# EasyEDA Pro project ProPrj_Inverted_MAML_6x6_2026-09-04(1).epro, schematic ETH_PHY
Create Date: 2025-12-23; Page Name: P1; Project Name: FPGA_motors_V3_0_4; Schematic Name: ETH_PHY; Update Date: 2025-12-23; Company: EasyEDA.com; Page Size: A4; Version: V1.0
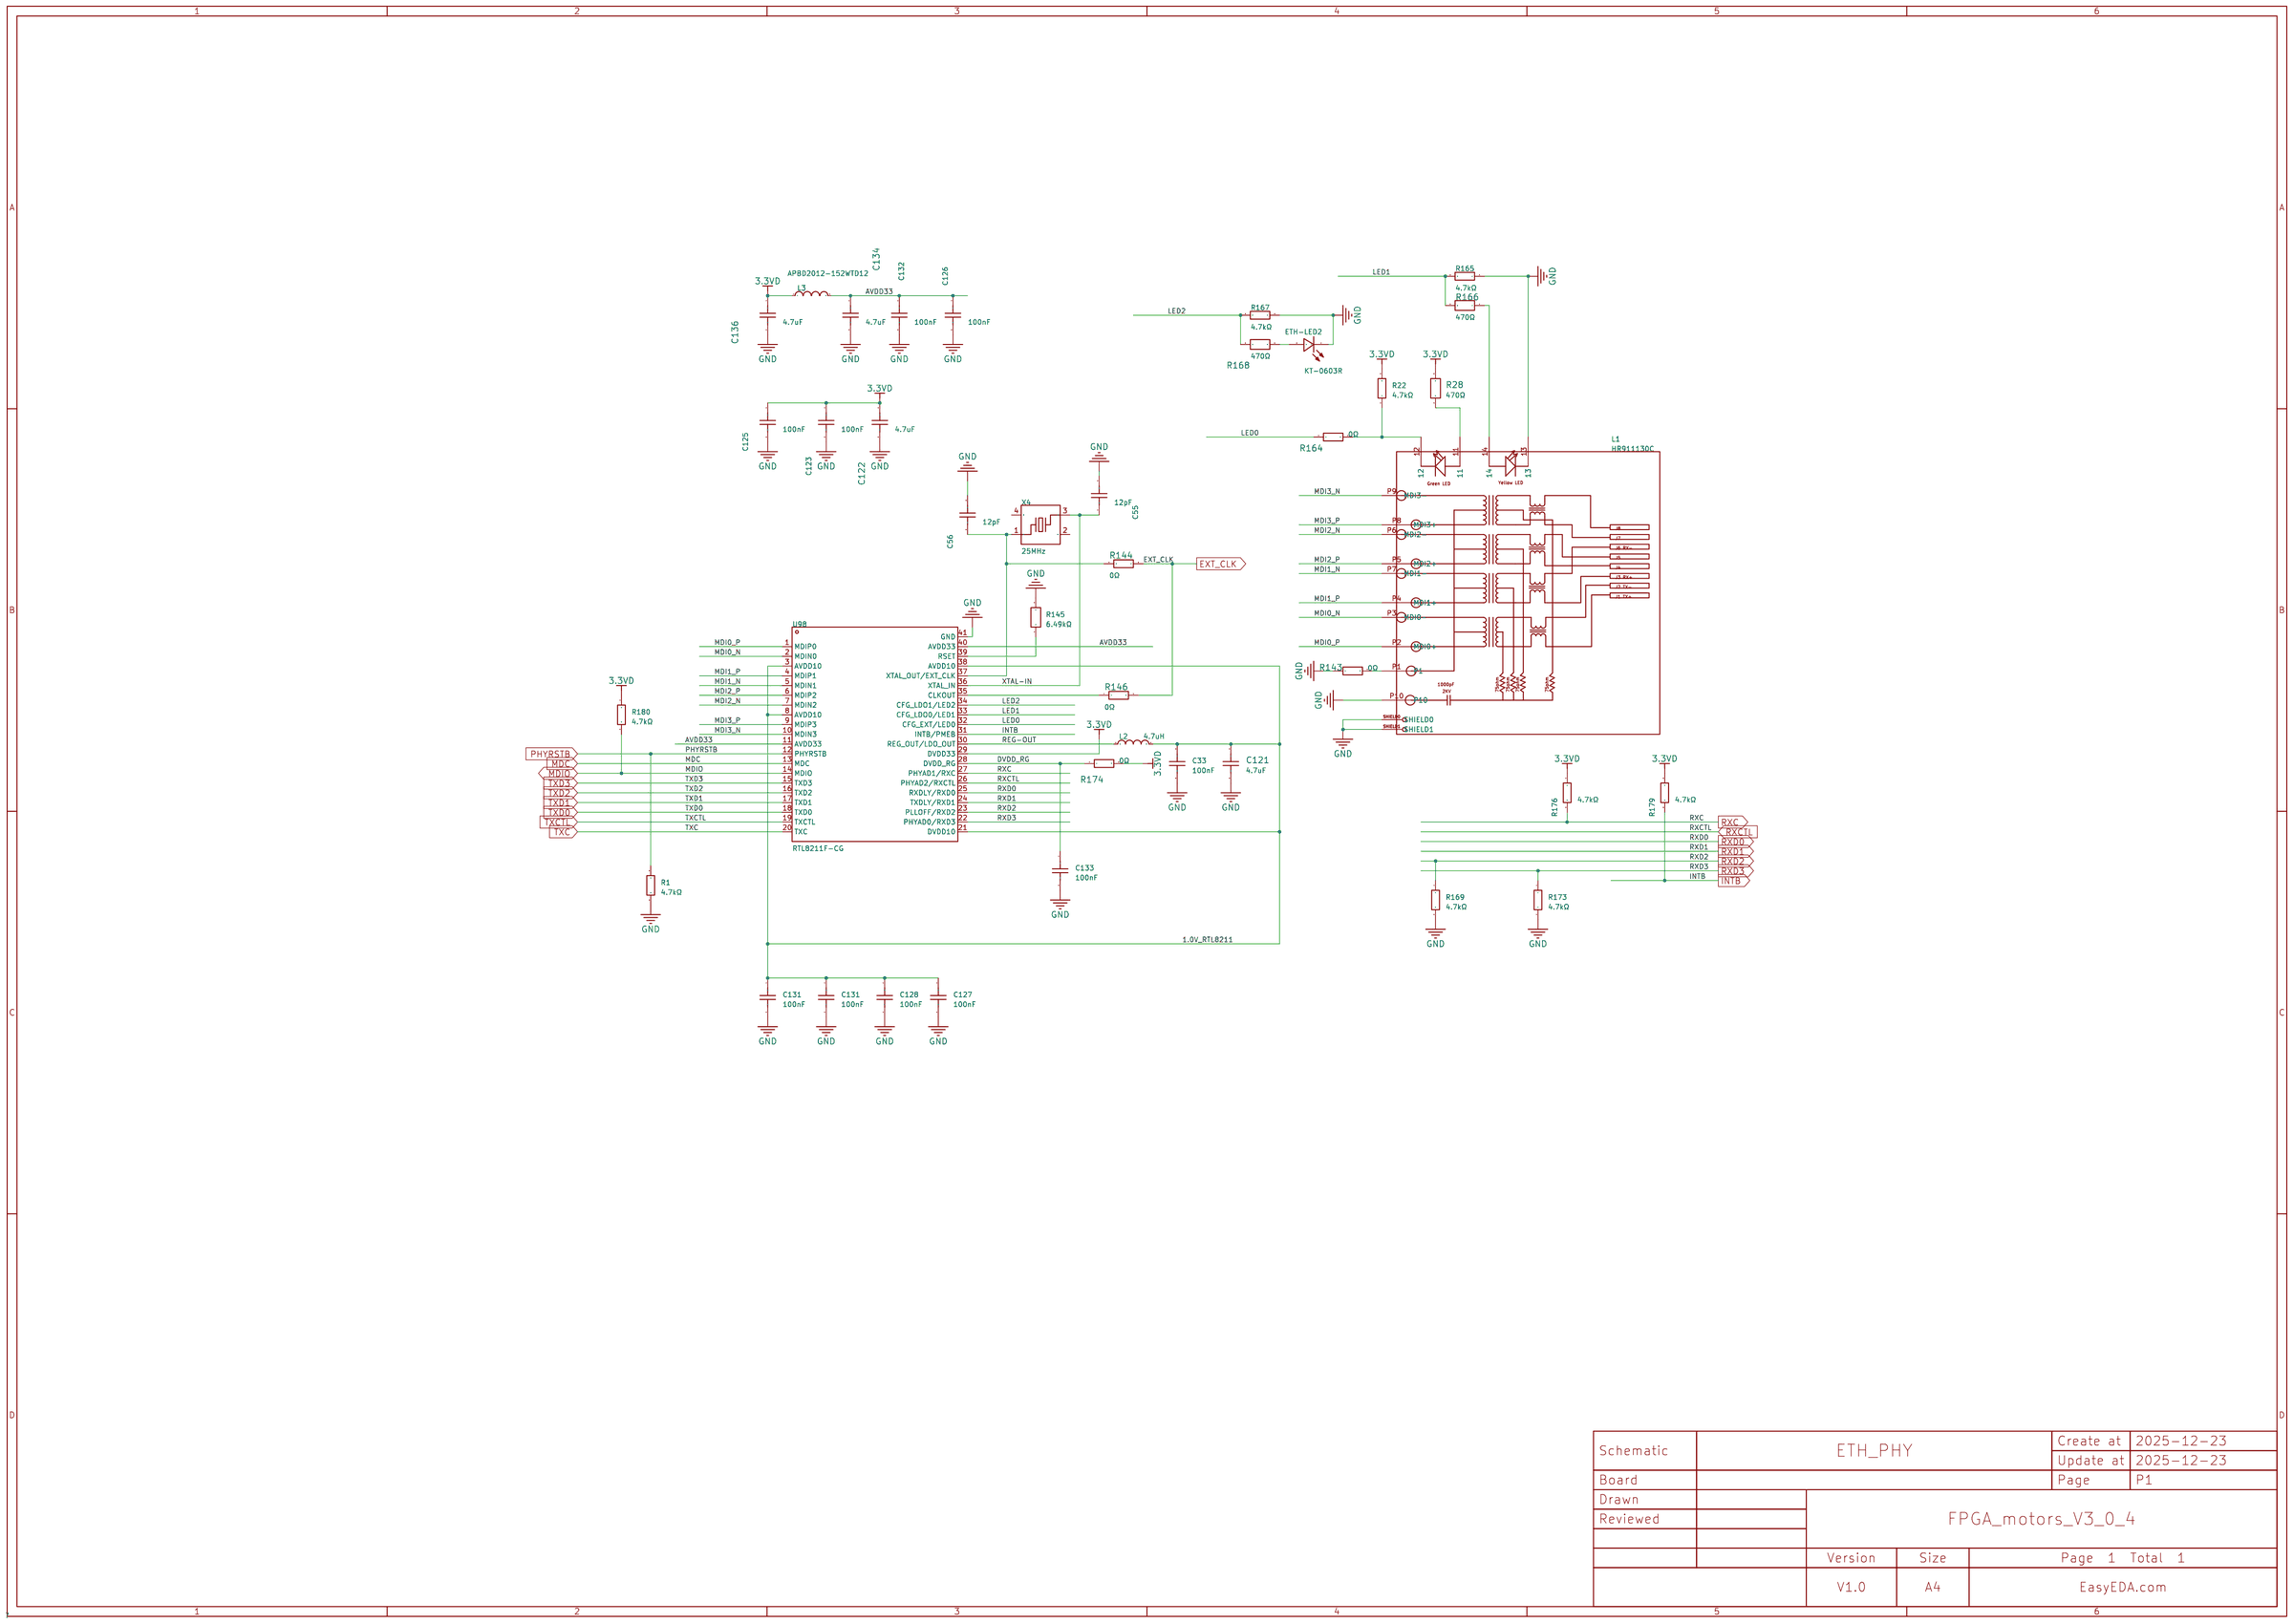
[diagram p3: schematic sheet]

## Parts
C33  100nF  [C0402]
C55  12pF  [C0402]
C56  12pF  [C0402]
C121  4.7uF  [C0402]
C122  4.7uF  [C0402]
C123  100nF  [C0402]
C125  100nF  [C0402]
C126  100nF  [C0402]
C127  100nF  [C0402]
C128  100nF  [C0402]
C131  100nF  [C0402]
C131#2  100nF  [C0402]
C132  100nF  [C0402]
C133  100nF  [C0402]
C134  4.7uF  [C0402]
C136  4.7uF  [C0402]
ETH-LED2  KT-0603R  [LED0603-RD]
L1  HR911130C  [RJ45-TH_HR911130C]
L2  4.7uH  [IND-SMD_L7.8-W7.0_SUMIDA_CD73]
L3  APBD2012-152WTD12  [L0805]
R1  4.7kΩ  [R0402]
R22  4.7kΩ  [R0402]
R28  470Ω  [R0402]
R143  0Ω  [R0402]
R144  0Ω  [R0402]  (no BOM)
R145  6.49kΩ  [R0402]
R146  0Ω  [R0402]  (no BOM)
R164  0Ω  [R0402]
R165  4.7kΩ  [R0402]
R166  470Ω  [R0402]
R167  4.7kΩ  [R0402]
R168  470Ω  [R0402]
R169  4.7kΩ  [R0402]
R173  4.7kΩ  [R0402]  (no BOM)
R174  0Ω  [R0402]
R176  4.7kΩ  [R0402]  (no BOM)
R179  4.7kΩ  [R0402]
R180  4.7kΩ  [R0402]
U98  RTL8211F-CG  [WQFN-40_L5.0-W5.0-P0.4-BL-EP]
X4  25MHz  [CRYSTAL-SMD_4P-L5.0-W3.2-BL]

## Library data of the parts
C33 C123 C125-C128 C131 C131#2 C132 C133 = CL05B104KB54PNC: Capacitance: Tolerance:±10% Tolerance:±10% Voltage Rated: Temperature Coefficient:; LCSC Part Name: 100nF ±10% 50V; Supplier Part: C307331; Manufacturer: SAMSUNG(三星); Supplier Footprint: 0402; JLCPCB Part Class: Basic Part; Datasheet: https://atta.szlcsc.com/upload/public/pdf/source/20160218/1457707763339.pdf; Supplier: LCSC; Tolerance: ±10%; Check: true
C55 C56 = V120J0402HQC500NBT: Capacitance:12pF Voltage Rating:50V Temperature Coefficient:C0G; LCSC Part Name: ±5pF 12pF 50V; Supplier Part: C5251212; Manufacturer: VIIYONG(微容); Supplier Footprint: 0402; JLCPCB Part Class: Extended Part; Datasheet: https://atta.szlcsc.com/upload/public/pdf/source/20210621/C2841456_D184B2C3CE76695828CADF567D00C122.pdf; Supplier: LCSC; Voltage Rating: 50V; Temperature Coefficient: C0G; Check: true
C121 C122 C134 C136 = LMK105BBJ475MVLF: Capacitance: Tolerance:±20% Tolerance:±20% Voltage Rated: Temperature Coefficient:; LCSC Part Name: 4.7uF ±20% 10V; Supplier Part: C23733; Manufacturer: TAIYO YUDEN(太诱); Supplier Footprint: 0402; JLCPCB Part Class: Extended Part; Datasheet: https://atta.szlcsc.com/upload/public/pdf/source/20210525/C2802164_C0429B055888A674C3F00BA74B841C5B.pdf; Supplier: LCSC; Tolerance: ±20%; Check: true
ETH-LED2 = KT-0603R: Emitted Color:Red Power Dissipation:- Forward Current:- Dominant Wavelength:- Dominant Wavelength:- Peak Wavelength:- Diode Configuration:- Lens Color:- Color Temperature:- Color Temperature:- Viewing Angle:- Mounting Sytle:- Operating Temperature:-40℃~+8; LCSC Part Name: 0603 红灯 高亮; Supplier Part: C2286; Manufacturer: KENTO; Supplier Footprint: 0603; JLCPCB Part Class: Basic Part; Datasheet: https://atta.szlcsc.com/upload/public/pdf/source/20160616/1466072038404.pdf; Supplier: LCSC; Emitted Color: Red; Operating Temperature: -40℃~+85℃
L1 = HR911130C: Connector Type:RJ45 Jack Mounting Type:Right Angle Number of Ports:1 LED:With LED Shielding:Shielded Ratings:- Operating Temperature:- Operating Temperature:-; LCSC Part Name: 弯插 带LED; Supplier Part: C50933; Manufacturer: HANRUN(汉仁); Supplier Footprint: 插件; JLCPCB Part Class: Extended Part; Datasheet: https://item.szlcsc.com/datasheet/HR911130C/51945.html; Supplier: LCSC; Connector Type: RJ45 Jack; Mounting Type: Right Angle; Number of Ports: 1; LED: With LED; Shielding: Shielded
L2 = FCD75-4R7M: Inductance:4.7uH Tolerance:±20% Tolerance:±20% Current - Saturation(Isat):4.2A DC Resistance(DCR):30mΩ Type:-; LCSC Part Name: SMD,7.8*7.0*5.0mm(0705)CD电感; Supplier Part: C41382395; Manufacturer: cjiang(长江微电); Supplier Footprint: SMD,7.8x7mm; Datasheet: https://atta.szlcsc.com/upload/public/pdf/source/20240910/39AFF787A42FA6B55710C93C1E169A83.pdf; Supplier: LCSC; Tolerance: ±20%; Current - Saturation(Isat): 4.2A; DC Resistance(DCR): 30mΩ
L3 = APBD2012-152WTD12: Impedance @ Frequency:1.5kΩ@100MHz Tolerance:±25% Tolerance:±25% DC Resistance(DCR):400mΩ Current Rating:550mA Operating Temperature:-55℃~+125℃ Operating Temperature:-55℃~+125℃; Supplier Part: C50325953; Manufacturer: APV(爱普微); Supplier Footprint: 0805; JLCPCB Part Class: Extended Part; Datasheet: https://item.szlcsc.com/datasheet/APBD2012-152WTD12/52921127.html; Supplier: LCSC; Impedance @ Frequency: 1.5kΩ@100MHz; Tolerance: ±25%; DC Resistance(DCR): 400mΩ; Current Rating: 550mA; Operating Temperature: -55℃~+125℃
R1 R22 R165 R167 R169 R173 R176 R179 R180 = 0402WGF4701TCE: Type:Thick Film Resistors Resistance:4.7kΩ Tolerance:±1% Tolerance:±1% Power(Watts): Overload Voltage (Max): Temperature Coefficient:±100ppm/℃ Temperature Coefficient:±100ppm/℃ Operating Temperature Range:-55℃~+155℃ Operating Temperature Range:-55℃~+155℃; LCSC Part Name: 4.7kΩ ±1% 62.5mW 厚膜电阻; Supplier Part: C25900; Manufacturer: UNI-ROYAL(厚声); Supplier Footprint: 0402; JLCPCB Part Class: Basic Part; Datasheet: https://item.szlcsc.com/datasheet/0402WGF4701TCE/26643.html; Supplier: LCSC; Type: Thick Film Resistor; Tolerance: ±1%; Power(Watts): 62.5mW; Voltage-Supply(Max): 50V; Temperature Coefficient: ±100ppm/℃; Operating Temperature: -55℃~+155℃
R28 R166 R168 = 0402WGF4700TCE: Type:Thick Film Resistors Resistance: Tolerance:±1% Tolerance:±1% Power(Watts): Overload Voltage (Max): Temperature Coefficient:±100ppm/℃ Temperature Coefficient:±100ppm/℃ Operating Temperature Range:-55℃~+155℃ Operating Temperature Range:-55℃~+155℃; LCSC Part Name: 470Ω ±1% 62.5mW 厚膜电阻; Supplier Part: C25117; Manufacturer: UNI-ROYAL(厚声); Supplier Footprint: 0402; JLCPCB Part Class: Basic Part; Datasheet: https://atta.szlcsc.com/upload/public/pdf/source/20200306/C422600_1E6D84923E4A46A82E41ADD87F860B5C.pdf; Supplier: LCSC; Type: Thick Film Resistors; Tolerance: ±1%; Temperature Coefficient: ±100ppm/℃; Operating Temperature Range: -55℃~+155℃
R143 R144 R146 R164 R174 = 0402WGF0000TCE: Type:Thick Film Resistor Resistance:0Ω Tolerance:±1% Tolerance:±1% Power(Watts):62.5mW Voltage-Supply(Max):50V Temperature Coefficient:±800ppm/℃ Temperature Coefficient:±800ppm/℃ Operating Temperature:-55℃~+155℃ Operating Temperature:-55℃~+155℃; LCSC Part Name: 0Ω ±1% 62.5mW 厚膜电阻; Supplier Part: C17168; Manufacturer: UNI-ROYAL(厚声); Supplier Footprint: 0402; JLCPCB Part Class: Basic Part; Datasheet: https://item.szlcsc.com/datasheet/0402WGF0000TCE/17853.html; Supplier: LCSC; Type: Thick Film Resistor; Tolerance: ±1%; Power(Watts): 62.5mW; Voltage-Supply(Max): 50V; Temperature Coefficient: ±800ppm/℃; Operating Temperature: -55℃~+155℃
R145 = RT0402BRE076K49L: Type:Thin Film Resistor Resistance: Tolerance:±0.1% Tolerance:±0.1% Power(Watts): Temperature Coefficient:±50ppm/℃ Temperature Coefficient:±50ppm/℃ Operating Temperature Range:-55℃~+155℃ Operating Temperature Range:-55℃~+155℃; LCSC Part Name: 薄膜电阻 6.49kΩ ±0.1% 62.5mW; Supplier Part: C853380; Manufacturer: YAGEO(国巨); Supplier Footprint: 0402; JLCPCB Part Class: Extended Part; Datasheet: https://atta.szlcsc.com/upload/public/pdf/source/20200610/C326738_5639A9F1B6EB6E4AE2197577D3456E7F.pdf; Supplier: LCSC; Type: Thin Film Resistor; Tolerance: ±0.1%; Temperature Coefficient: ±50ppm/℃; Operating Temperature Range: -55℃~+155℃
U98 = RTL8211F-CG: Applications Function:- Number of Channels:- MAC Interface:RGMII Voltage - Supply:1.8V；2.5V；3.3V；1.5V Voltage - Supply:1.8V；2.5V；3.3V；1.5V; LCSC Part Name: 集成10/100/1000M以太网精密收发器; Supplier Part: C187932; Manufacturer: REALTEK(瑞昱); Supplier Footprint: WQFN-40-EP(5x5); JLCPCB Part Class: Extended Part; Datasheet: https://item.szlcsc.com/datasheet/RTL8211F-CG/199338.html; Supplier: LCSC; MAC Interface: RGMII; Voltage - Supply: 1.8V；2.5V；3.3V；1.5V
X4 = XC53M4-25.000-F12JJDT: Type:Surface Mount Crystal Frequency:25MHz Normal temperature Frequency Tolerance:±30ppm Normal temperature Frequency Tolerance:±30ppm Load Capacitance:12pF Frequency Stability:±30ppm Frequency Stability:±30ppm Equivalent Series Resistance(ESR):50Ω Operat; LCSC Part Name: 25MHz ±30ppm 12pF; Supplier Part: C2916916; Manufacturer: HCI(杭晶); Supplier Footprint: SMD5032-4P; JLCPCB Part Class: Extended Part; Datasheet: https://atta.szlcsc.com/upload/public/pdf/source/20220525/EE70191DC8EBB19615A77EA6B0DDD31A.pdf; Supplier: LCSC; Type: Surface Mount Crystal; Normal temperature Frequency Tolerance: ±30ppm; Load Capacitance: 12pF; Frequency Stability: ±30ppm; Equivalent Series Resistance(ESR): 50Ω

## Nets
1.0V_RTL8211: C33.1 C121.1 C127.1 C128.1 C131.1 C131#2.1 L2.2 U98.3(AVDD10) U98.8(AVDD10) U98.21(DVDD10) U98.38(AVDD10)
3.3VD: C122.1 C123.1 C125.1 C136.1 L3.1 R22.2 R28.2 R174.2 R176.1 R179.1 R180.1 U98.29(DVDD33)
AVDD33: C126.1 C132.1 C134.1 L3.2 U98.11(AVDD33) U98.40(AVDD33)
DVDD_RG: C133.1 R174.1 U98.28(DVDD_RG)
GND: C33.2 C55.2 C56.2 C121.2 C122.2 C123.2 C125.2 C126.2 C127.2 C128.2 C131.2 C131#2.2 C132.2 C133.2 C134.2 C136.2 ETH-LED2.1(K) L1.13 L1.P10 L1.SHIELD0 L1.SHIELD1 R1.2 R143.1 R145.2 R165.1 R167.1 R169.2 R173.2 U98.41(GND)
EXT_CLK: R144.2 R146.2
INTB: R179.2 U98.31(INTB/PMEB)
LED0: R164.1 U98.32(CFG_EXT/LED0)
LED1: R165.2 R166.2 U98.33(CFG_LDO0/LED1)
LED2: R167.2 R168.2 U98.34(CFG_LDO1/LED2)
MDC: U98.13(MDC)
MDI0_N: L1.P3(MDI0-) U98.2(MDIN0)
MDI0_P: L1.P2(MDI0+) U98.1(MDIP0)
MDI1_N: L1.P7(MDI1-) U98.5(MDIN1)
MDI1_P: L1.P4(MDI1+) U98.4(MDIP1)
MDI2_N: L1.P6(MDI2-) U98.7(MDIN2)
MDI2_P: L1.P5(MDI2+) U98.6(MDIP2)
MDI3_N: L1.P9(MDI3-) U98.10(MDIN3)
MDI3_P: L1.P8(MDI3+) U98.9(MDIP3)
MDIO: R180.2 U98.14(MDIO)
PHYRSTB: R1.1 U98.12(PHYRSTB)
REG-OUT: L2.1 U98.30(REG_OUT/LDO_OUT)
RXC: R176.2 U98.27(PHYAD1/RXC)
RXCTL: U98.26(PHYAD2/RXCTL)
RXD0: U98.25(RXDLY/RXD0)
RXD1: U98.24(TXDLY/RXD1)
RXD2: R169.1 U98.23(PLLOFF/RXD2)
RXD3: R173.1 U98.22(PHYAD0/RXD3)
TXC: U98.20(TXC)
TXCTL: U98.19(TXCTL)
TXD0: U98.18(TXD0)
TXD1: U98.17(TXD1)
TXD2: U98.16(TXD2)
TXD3: U98.15(TXD3)
XTAL-IN: C55.1 U98.36(XTAL_IN) X4.3
Net-(C56-1): C56.1 R144.1 U98.37(XTAL_OUT/EXT_CLK) X4.1
Net-(ETH-LED2-2): ETH-LED2.2(A) R168.1
Net-(L1-11): L1.11 R28.1
Net-(L1-12): L1.12 R22.1 R164.2
Net-(L1-14): L1.14 R166.1
Net-(L1-P1): L1.P1 R143.2
Net-(R145-1): R145.1 U98.39(RSET)
Net-(R146-1): R146.1 U98.35(CLKOUT)

Not connected (* = marked no-connect by the designer): X4 2(GND) 4(GND)
